# EAGLE design XboxSerialAdapter (EAGLE 9.6.2)
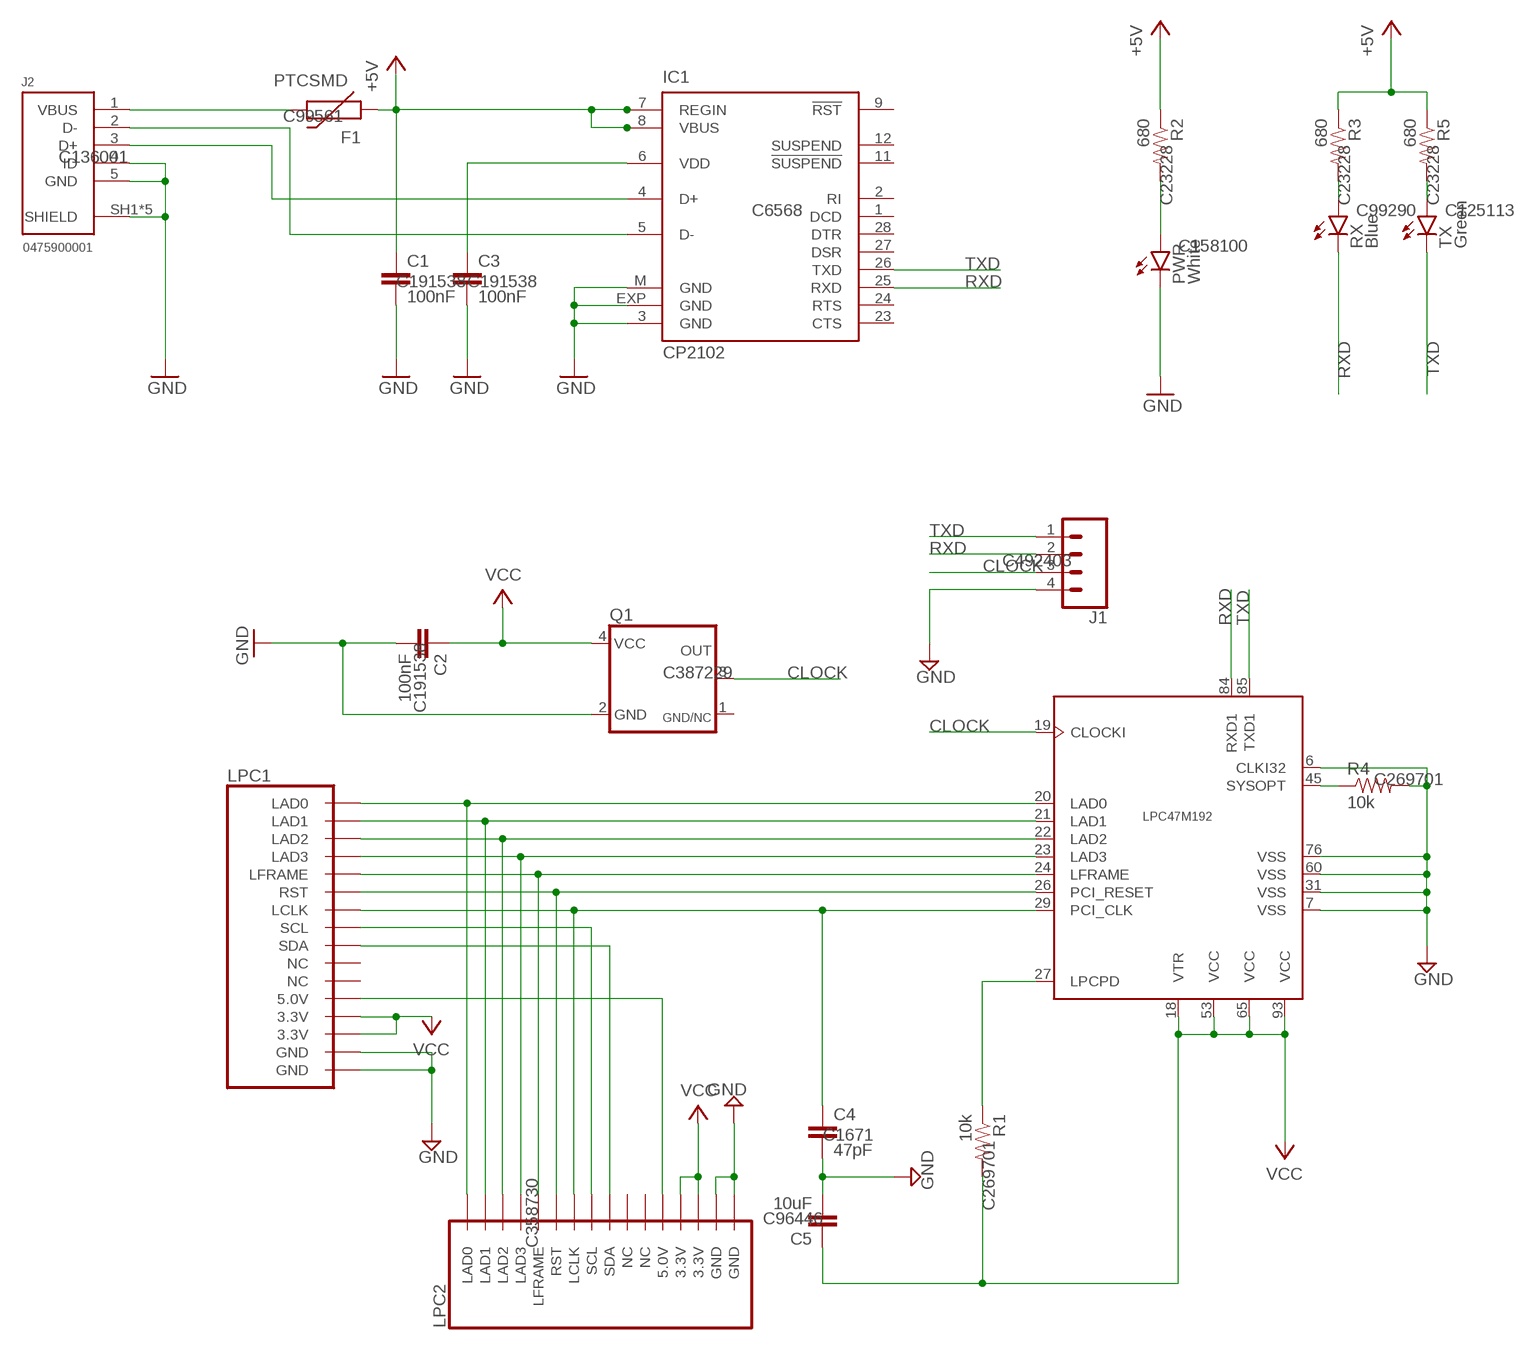
[diagram p0: schematic, sheet 1]

## Parts
C1  100nF  CAP0603-CAP  [0603-CAP]
C2  100nF  CAP0603-CAP  [0603-CAP]
C3  100nF  CAP0603-CAP  [0603-CAP]
C4  47pF  CAP0603-CAP  [0603-CAP]
C5  10uF  CAP0603-CAP  [0603-CAP]
F1  PTCSMD  [PTC-1206]
IC1  CP2102  [MLP28]
J1  CONN_04  [1X04]
J2  0475900001  [0475900001]
LPC1  LPC_HEADERLPC_FEMALE  [HDRVR16W64P254_2X8_1524X508X254B]
LPC2  LPC_HEADERLPC_FEMALE  [HDRVR16W64P254_2X8_1524X508X254B]
PWR  White  LEDCHIP-LED0603  [CHIP-LED0603]
Q1  SCTF_C3872291  [SCTF_C387229]
R1  10k  RESISTOR0603-RES  [0603-RES]
R2  680  RESISTOR0603-RES  [0603-RES]
R3  680  RESISTOR0603-RES  [0603-RES]
R4  10k  RESISTOR0603-RES  [0603-RES]
R5  680  RESISTOR0603-RES  [0603-RES]
RX  Blue  LEDCHIP-LED0603  [CHIP-LED0603]
TX  Green  LEDCHIP-LED0603  [CHIP-LED0603]
U1  LPC47M192  [QFP128]

## Nets
5.0V: LPC1.6(5.0V) LPC2.6(5.0V)
+5V: C1.1 F1.1 IC1.7(REGIN) IC1.8(VBUS) R2.1 R3.1 R5.1
CLOCK: J1.3 Q1.3(OUT) U1.19(CLOCKI)
D+: IC1.4(D+) J2.3(D+)
D-: IC1.5(D-) J2.2(D-)
GND: C1.2 C2.2 C3.2 C4.2 C5.2 IC1.3(GND) IC1.EXP(GND) IC1.M(GND) J1.4 J2.4(ID) J2.5(GND) J2.SH1(SHIELD) J2.SH2(SHIELD) J2.SH3(SHIELD) J2.SH4(SHIELD) J2.SH5(SHIELD) LPC1.2(GND) LPC1.12(GND) LPC2.2(GND) LPC2.12(GND) PWR.C Q1.2(GND) R4.2 U1.6(CLKI32) U1.7(VSS) U1.31(VSS) U1.60(VSS) U1.76(VSS)
LAD0: LPC1.11(LAD0) LPC2.11(LAD0) U1.20(LAD0)
LAD1: LPC1.10(LAD1) LPC2.10(LAD1) U1.21(LAD1)
LAD2: LPC1.8(LAD2) LPC2.8(LAD2) U1.22(LAD2)
LAD3: LPC1.7(LAD3) LPC2.7(LAD3) U1.23(LAD3)
LCLK: C4.1 LPC1.1(LCLK) LPC2.1(LCLK) U1.29(PCI_CLK)
LFRAME: LPC1.3(LFRAME) LPC2.3(LFRAME) U1.24(LFRAME)
N$1: R4.1 U1.45(SYSOPT)
N$2: R5.2 TX.A
N$4: R3.2 RX.A
N$5: C3.1 IC1.6(VDD)
N$6: R1.1 U1.27(LPCPD)
N$8: PWR.A R2.2
RST: LPC1.5(RST) LPC2.5(RST) U1.26(PCI_RESET)
RXD: IC1.25(RXD) J1.2 RX.C U1.84(RXD1)
SCL: LPC1.13(SCL) LPC2.13(SCL)
SDA: LPC1.14(SDA) LPC2.14(SDA)
TXD: IC1.26(TXD) J1.1 TX.C U1.85(TXD1)
VBUS: F1.2 J2.1(VBUS)
VCC: C2.1 C5.1 LPC1.9(3.3V) LPC1.15(3.3V) LPC2.9(3.3V) LPC2.15(3.3V) Q1.4(VCC) R1.2 U1.18(VTR) U1.53(VCC) U1.65(VCC) U1.93(VCC)
Unconnected: IC1.1(DCD) IC1.2(RI) IC1.9(!RST) IC1.11(!SUSPEND) IC1.12(SUSPEND) IC1.23(CTS) IC1.24(RTS) IC1.27(DSR) IC1.28(DTR) LPC1.4(NC) LPC1.16(NC) LPC2.4(NC) LPC2.16(NC)

## Power pins joined to a net without a drawn wire
GND/NC: Q1.1(GND/NC)

## Library data of the parts
C1-C3 = SparkFun:CAP: Capacitor Standard 0603 ceramic capacitor, and 0.1" leaded capacitor.; LCSC_PART: C191538
C4 = SparkFun:CAP: Capacitor Standard 0603 ceramic capacitor, and 0.1" leaded capacitor.; LCSC_PART: C1671
C5 = SparkFun:CAP: Capacitor Standard 0603 ceramic capacitor, and 0.1" leaded capacitor.; LCSC_PART: C96446
F1 = SparkFun:PTC: Resettable Fuse PTC Resettable Fuse. Spark Fun Electronics SKU : COM-08357; LCSC_PART: C99561
IC1 = silabs:CP210*: Single-Chip USB to UART Bridge Source: www.silabs.com .. CP2101.pdf / cp2102.pdf; LCSC_PART: C6568; MF: FARNELL; MPN: CP2102-GM; OC_FARNELL: 9282130; OC_NEWARK: 30K5635
J1 = SparkFun-Connectors:CONN_04: Multi connection point. Often used as Generic Header-pin footprint for 0.1 inch spaced/style header connections On any of the 0.1 inch spaced packages, you can populate with these: Break Away Headers - Straight <https://www.sparkfun.com/products/116> (PRT-00116) Break Away Male Headers - Right Angle <https://www.sparkfun.com/products/553> (PRT-00553) Female Headers <https://www.sparkfun.com/products/115> (PRT-00115) Break Away Headers - Machine Pin <https://www.sparkfun.com/products/117> (PRT-00117) Break Away Female Headers - Swiss Machine Pin <https://www.sparkfun.com/products/743> (PRT-00743) For SCREWTERMINALS and SPRING TERMINALS visit here: Screw Terimnals on SparkFun.com <https://www.sparkfun.com/search/results?term=Screw+Terminals> (5mm/3.5mm/2.54mm spacing) This device is also useful as a general connection point to wire up your design to another part of your project. Our various solder wires solder well into these plated through hole pads. Hook-Up Wire - Assortment (Stranded, 22 AWG) <https://www.sparkfun.com/products/11375> (PRT-11375) Hook-Up Wire - Assortment (Solid Core, 22 AWG) <https://www.sparkfun.com/products/11367> (PRT-11367) View the entire wire category on our website here <https://www.sparkfun.com/categories/141> Special notes: Molex polarized connector foot print use with SKU : PRT-08231 with associated crimp pins and housings. 1MM SMD Version SKU: PRT-10208; LCSC_PART: C492403; PROD_ID: CONN-09696
J2 = USB connector:0475900001: CONN RCPT MICRO USB AB 5P SMD RA Manufacturer's datasheet <https://www.molex.com/pdm_docs/sd/475900001_sd.pdf>; CREATED_BY: PCBLayout.com; DIGIKEY_PARTNO: WM17144TR-ND; LCSC_PART: C136001; MANUFACTURER: Molex; MPN: 0475900001
LPC1 = xbox:LPC_HEADER: Multi connection point. Often used as Generic Header-pin footprint for 0.1 inch spaced/style header connections You can populate with any combo of single row headers, but if you'd like an exact match, check this: Header - 2x8 (Male, 0.1") <https://www.sparkfun.com/products/13156> (PRT-13156) On any of the 0.1 inch spaced packages, you can populate with these: Break Away Headers - Straight <https://www.sparkfun.com/products/116> (PRT-00116) Break Away Male Headers - Right Angle <https://www.sparkfun.com/products/553> (PRT-00553) Female Headers <https://www.sparkfun.com/products/115> (PRT-00115) Break Away Headers - Machine Pin <https://www.sparkfun.com/products/117> (PRT-00117) Break Away Female Headers - Swiss Machine Pin <https://www.sparkfun.com/products/743> (PRT-00743); LCSC_PART: C492425
LPC2 = xbox:LPC_HEADER: Multi connection point. Often used as Generic Header-pin footprint for 0.1 inch spaced/style header connections You can populate with any combo of single row headers, but if you'd like an exact match, check this: Header - 2x8 (Male, 0.1") <https://www.sparkfun.com/products/13156> (PRT-13156) On any of the 0.1 inch spaced packages, you can populate with these: Break Away Headers - Straight <https://www.sparkfun.com/products/116> (PRT-00116) Break Away Male Headers - Right Angle <https://www.sparkfun.com/products/553> (PRT-00553) Female Headers <https://www.sparkfun.com/products/115> (PRT-00115) Break Away Headers - Machine Pin <https://www.sparkfun.com/products/117> (PRT-00117) Break Away Female Headers - Swiss Machine Pin <https://www.sparkfun.com/products/743> (PRT-00743); LCSC_PART: C358730
PWR = led:LED: LED OSRAM: - CHIPLED LG R971, LG N971, LY N971, LG Q971, LY Q971, LO R971, LY R971 LH N974, LH R974 LS Q976, LO Q976, LY Q976 LO Q996 - Hyper CHIPLED LW Q18S LB Q993, LB Q99A, LB R99A - SideLED LS A670, LO A670, LY A670, LG A670, LP A670 LB A673, LV A673, LT A673, LW A673 LH A674 LY A675 LS A676, LA A676, LO A676, LY A676, LW A676 LS A679, LY A679, LG A679 - Hyper Micro SIDELED® LS Y876, LA Y876, LO Y876, LY Y876 LT Y87S - SmartLED LW L88C, LW L88S LB L89C, LB L89S, LG L890 LS L89K, LO L89K, LY L89K LS L896, LA L896, LO L896, LY L896 - TOPLED LS T670, LO T670, LY T670, LG T670, LP T670 LSG T670, LSP T670, LSY T670, LOP T670, LYG T670 LG T671, LOG T671, LSG T671 LB T673, LV T673, LT T673, LW T673 LH T674 LS T676, LA T676, LO T676, LY T676, LB T676, LH T676, LSB T676, LW T676 LB T67C, LV T67C, LT T67C, LS T67K, LO T67K, LY T67K, LW E67C LS E67B, LA E67B, LO E67B, LY E67B, LB E67C, LV E67C, LT E67C LW T67C LS T679, LY T679, LG T679 LS T770, LO T770, LY T770, LG T770, LP T770 LB T773, LV T773, LT T773, LW T773 LH T774 LS E675, LA E675, LY E675, LS T675 LS T776, LA T776, LO T776, LY T776, LB T776 LHGB T686 LT T68C, LB T68C - Hyper Mini TOPLED® LB M676 - Mini TOPLED Santana® LG M470 LS M47K, LO M47K, LY M47K Source: http://www.osram.convergy.de LUXEON: - LUMILED® LXK2-PW12-R00, LXK2-PW12-S00, LXK2-PW14-U00, LXK2-PW14-V00 LXK2-PM12-R00, LXK2-PM12-S00, LXK2-PM14-U00 LXK2-PE12-Q00, LXK2-PE12-R00, LXK2-PE12-S00, LXK2-PE14-T00, LXK2-PE14-U00 LXK2-PB12-K00, LXK2-PB12-L00, LXK2-PB12-M00, LXK2-PB14-N00, LXK2-PB14-P00, LXK2-PB14-Q00 LXK2-PR12-L00, LXK2-PR12-M00, LXK2-PR14-Q00, LXK2-PR14-R00 LXK2-PD12-Q00, LXK2-PD12-R00, LXK2-PD12-S00 LXK2-PH12-R00, LXK2-PH12-S00 LXK2-PL12-P00, LXK2-PL12-Q00, LXK2-PL12-R00 Source: www.luxeon.com KINGBRIGHT: KA-3528ASYC Source: www.kingbright.com; LCSC_PART: C158100
Q1 = xbox:SCTF_C387229: TCXO : CMOS - Serie Model Size l/w/h [mm] Frequency Range Frequency Stability Temp. Range [°C] Output AECQ 200 availabel Datasheet KXO-86 KXO-84 KXO-83 KXO-82 2.5/2.0/0.7 3.2/2.5/1.0 5.0/3.2/1.5 7.0/5.0/2.4 13,0 ~ 40,0 MHz 10,0 ~ 40,0 MHz 10,0 ~ 40,0 MHz 10,0 ~ 30,0 MHz ±1,0 … ±2,5ppm ±1,0 … ±2,5ppm ±1,0 … ±3,0ppm ±1,0 … ±3,0ppm (*) -30°C …+75°C (*) -40°C …+85°C (*) -40°C …+85°C (*) -30°C …+80°C CMOS CMOS CMOS CMOS - - - - KXO-86.pdf <http://www.geyer-electronic.de/uploads/tx_userartikelfrequenz/GEYER-KXO-86-TCXO-HCMOS.pdf> KXO-84.pdf <http://www.geyer-electronic.de/uploads/tx_userartikelfrequenz/GEYER-KXO-84-TCXO-HCMOS.pdf> KXO-83.pdf <http://www.geyer-electronic.de/uploads/tx_userartikelfrequenz/GEYER-KXO-83-TCXO-HCMOS.pdf> KXO-82.pdf <http://www.geyer-electronic.de/uploads/tx_userartikelfrequenz/GEYER-KXO-82-TCXO-HCMOS.pdf> <http://www.geyer-electronic.de/fileadmin/template/img/logo-geyer-electronic.png> Details see: http://www.geyer-electronic.de/Frequenz-Produkte.9.0.html Created 2016-06-07, Hans Locher 2016 (C) Geyer Quartz Technology KXO86,KXO84,KXO83,KXO82;2550;3225;5032;7050;2,5x2,0;3,2x2,5;2.5x2.0;3.2x2.5,5,0x3,2;7,0x5,0,5.0x3.2,7.0x5.0; LCSC_PART: C387229
R1 R4 = SparkFun:RESISTOR: Resistor Basic schematic elements and footprints for 0603, 1206, and PTH resistors.; LCSC_PART: C269701
R2 R3 R5 = SparkFun:RESISTOR: Resistor Basic schematic elements and footprints for 0603, 1206, and PTH resistors.; LCSC_PART: C23228
RX = led:LED: LED OSRAM: - CHIPLED LG R971, LG N971, LY N971, LG Q971, LY Q971, LO R971, LY R971 LH N974, LH R974 LS Q976, LO Q976, LY Q976 LO Q996 - Hyper CHIPLED LW Q18S LB Q993, LB Q99A, LB R99A - SideLED LS A670, LO A670, LY A670, LG A670, LP A670 LB A673, LV A673, LT A673, LW A673 LH A674 LY A675 LS A676, LA A676, LO A676, LY A676, LW A676 LS A679, LY A679, LG A679 - Hyper Micro SIDELED® LS Y876, LA Y876, LO Y876, LY Y876 LT Y87S - SmartLED LW L88C, LW L88S LB L89C, LB L89S, LG L890 LS L89K, LO L89K, LY L89K LS L896, LA L896, LO L896, LY L896 - TOPLED LS T670, LO T670, LY T670, LG T670, LP T670 LSG T670, LSP T670, LSY T670, LOP T670, LYG T670 LG T671, LOG T671, LSG T671 LB T673, LV T673, LT T673, LW T673 LH T674 LS T676, LA T676, LO T676, LY T676, LB T676, LH T676, LSB T676, LW T676 LB T67C, LV T67C, LT T67C, LS T67K, LO T67K, LY T67K, LW E67C LS E67B, LA E67B, LO E67B, LY E67B, LB E67C, LV E67C, LT E67C LW T67C LS T679, LY T679, LG T679 LS T770, LO T770, LY T770, LG T770, LP T770 LB T773, LV T773, LT T773, LW T773 LH T774 LS E675, LA E675, LY E675, LS T675 LS T776, LA T776, LO T776, LY T776, LB T776 LHGB T686 LT T68C, LB T68C - Hyper Mini TOPLED® LB M676 - Mini TOPLED Santana® LG M470 LS M47K, LO M47K, LY M47K Source: http://www.osram.convergy.de LUXEON: - LUMILED® LXK2-PW12-R00, LXK2-PW12-S00, LXK2-PW14-U00, LXK2-PW14-V00 LXK2-PM12-R00, LXK2-PM12-S00, LXK2-PM14-U00 LXK2-PE12-Q00, LXK2-PE12-R00, LXK2-PE12-S00, LXK2-PE14-T00, LXK2-PE14-U00 LXK2-PB12-K00, LXK2-PB12-L00, LXK2-PB12-M00, LXK2-PB14-N00, LXK2-PB14-P00, LXK2-PB14-Q00 LXK2-PR12-L00, LXK2-PR12-M00, LXK2-PR14-Q00, LXK2-PR14-R00 LXK2-PD12-Q00, LXK2-PD12-R00, LXK2-PD12-S00 LXK2-PH12-R00, LXK2-PH12-S00 LXK2-PL12-P00, LXK2-PL12-Q00, LXK2-PL12-R00 Source: www.luxeon.com KINGBRIGHT: KA-3528ASYC Source: www.kingbright.com; LCSC_PART: C99290
TX = led:LED: LED OSRAM: - CHIPLED LG R971, LG N971, LY N971, LG Q971, LY Q971, LO R971, LY R971 LH N974, LH R974 LS Q976, LO Q976, LY Q976 LO Q996 - Hyper CHIPLED LW Q18S LB Q993, LB Q99A, LB R99A - SideLED LS A670, LO A670, LY A670, LG A670, LP A670 LB A673, LV A673, LT A673, LW A673 LH A674 LY A675 LS A676, LA A676, LO A676, LY A676, LW A676 LS A679, LY A679, LG A679 - Hyper Micro SIDELED® LS Y876, LA Y876, LO Y876, LY Y876 LT Y87S - SmartLED LW L88C, LW L88S LB L89C, LB L89S, LG L890 LS L89K, LO L89K, LY L89K LS L896, LA L896, LO L896, LY L896 - TOPLED LS T670, LO T670, LY T670, LG T670, LP T670 LSG T670, LSP T670, LSY T670, LOP T670, LYG T670 LG T671, LOG T671, LSG T671 LB T673, LV T673, LT T673, LW T673 LH T674 LS T676, LA T676, LO T676, LY T676, LB T676, LH T676, LSB T676, LW T676 LB T67C, LV T67C, LT T67C, LS T67K, LO T67K, LY T67K, LW E67C LS E67B, LA E67B, LO E67B, LY E67B, LB E67C, LV E67C, LT E67C LW T67C LS T679, LY T679, LG T679 LS T770, LO T770, LY T770, LG T770, LP T770 LB T773, LV T773, LT T773, LW T773 LH T774 LS E675, LA E675, LY E675, LS T675 LS T776, LA T776, LO T776, LY T776, LB T776 LHGB T686 LT T68C, LB T68C - Hyper Mini TOPLED® LB M676 - Mini TOPLED Santana® LG M470 LS M47K, LO M47K, LY M47K Source: http://www.osram.convergy.de LUXEON: - LUMILED® LXK2-PW12-R00, LXK2-PW12-S00, LXK2-PW14-U00, LXK2-PW14-V00 LXK2-PM12-R00, LXK2-PM12-S00, LXK2-PM14-U00 LXK2-PE12-Q00, LXK2-PE12-R00, LXK2-PE12-S00, LXK2-PE14-T00, LXK2-PE14-U00 LXK2-PB12-K00, LXK2-PB12-L00, LXK2-PB12-M00, LXK2-PB14-N00, LXK2-PB14-P00, LXK2-PB14-Q00 LXK2-PR12-L00, LXK2-PR12-M00, LXK2-PR14-Q00, LXK2-PR14-R00 LXK2-PD12-Q00, LXK2-PD12-R00, LXK2-PD12-S00 LXK2-PH12-R00, LXK2-PH12-S00 LXK2-PL12-P00, LXK2-PL12-Q00, LXK2-PL12-R00 Source: www.luxeon.com KINGBRIGHT: KA-3528ASYC Source: www.kingbright.com; LCSC_PART: C125113
U1 = xbox:LPC47M192

## Board
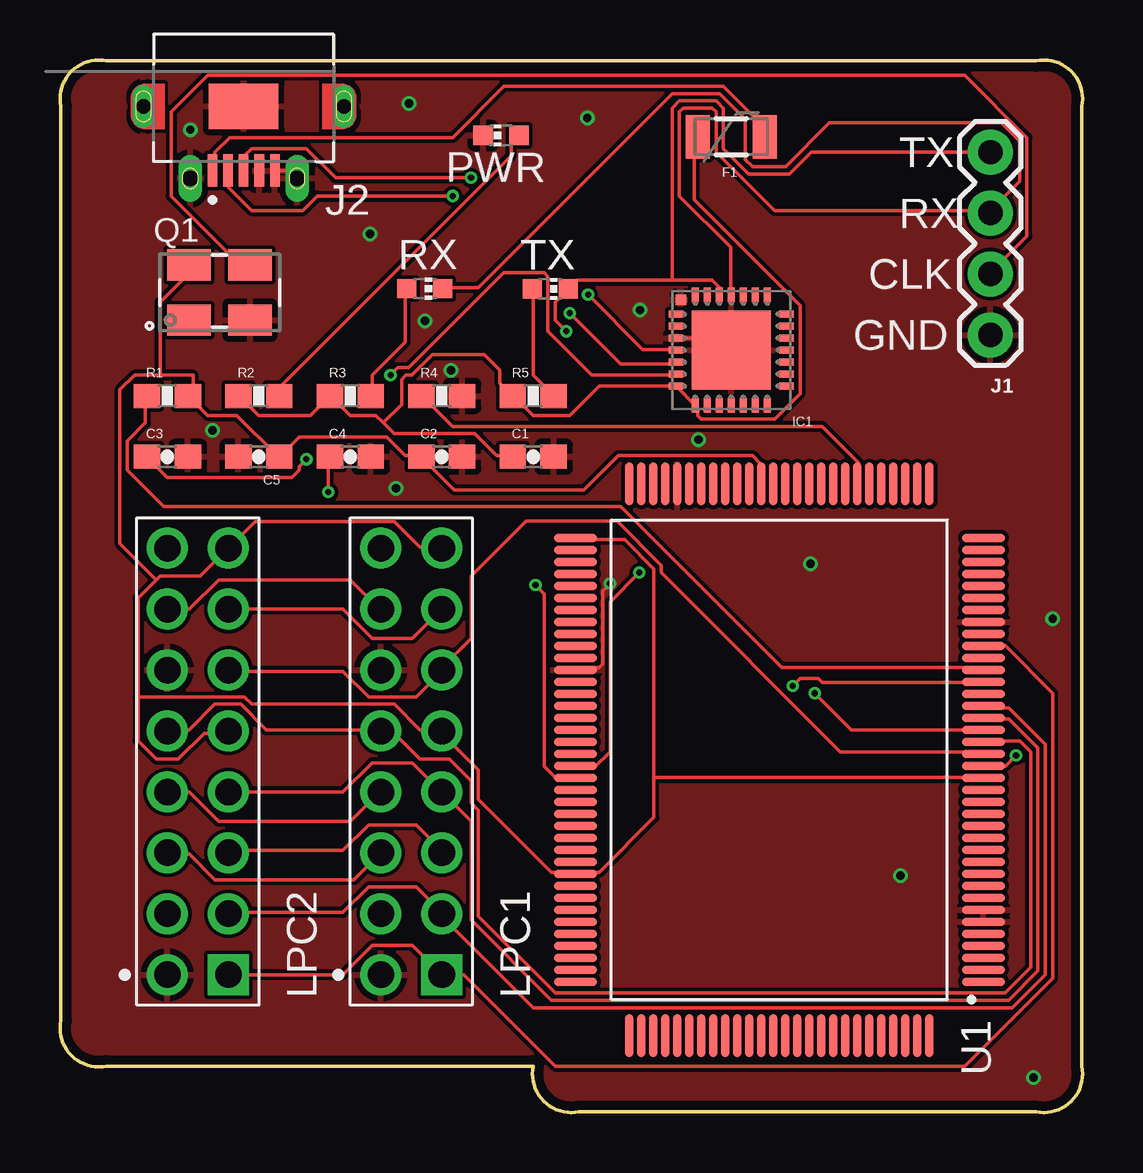
[diagram p1: board, top side]
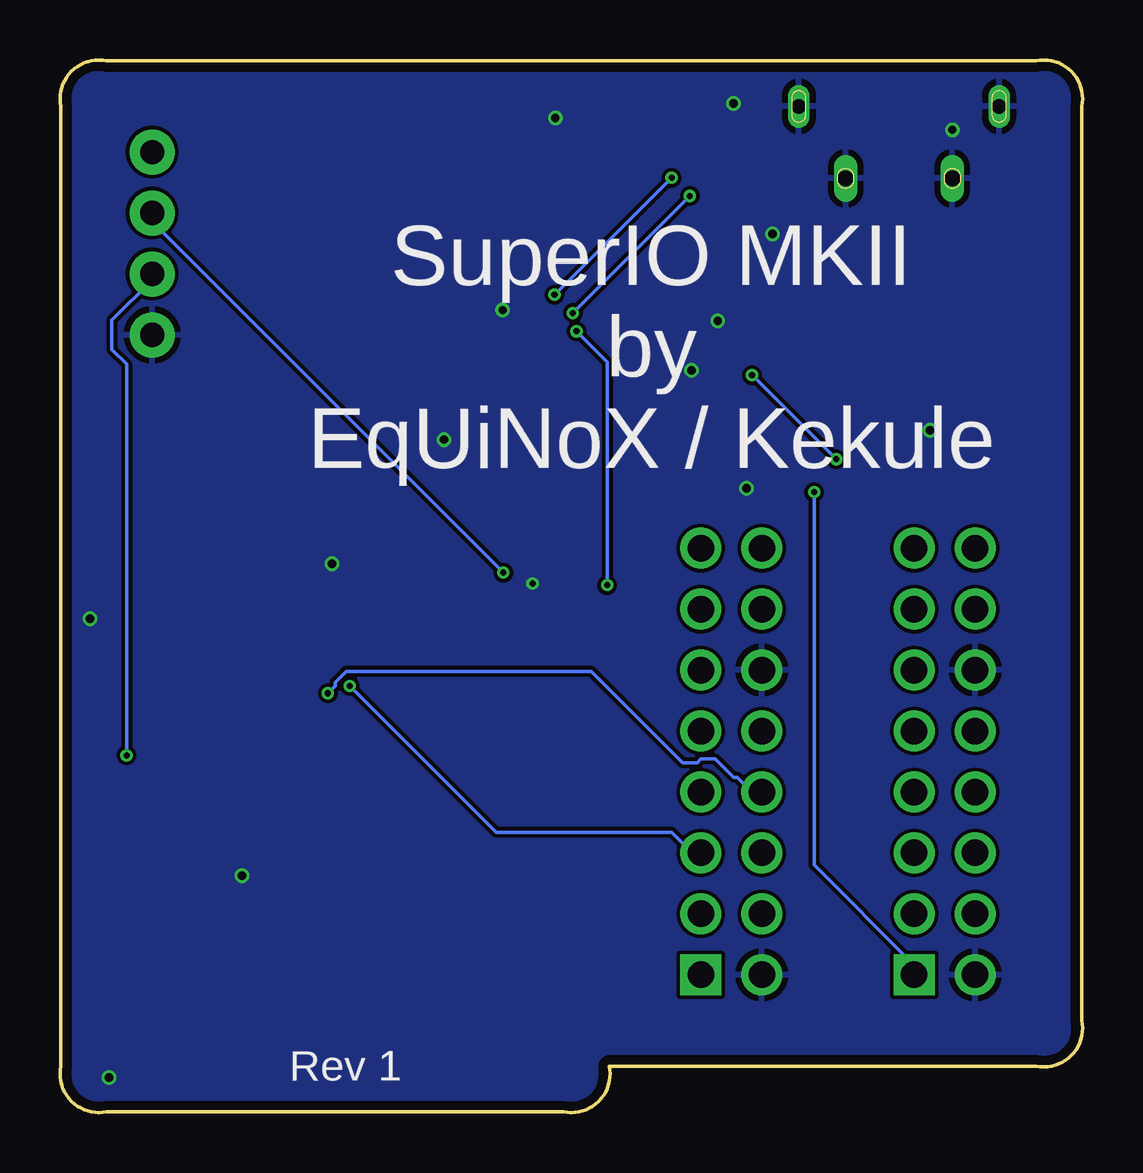
[diagram p2: board, bottom side, seen from below]

Size 42.61 x 43.88 mm. Coordinates in mm from the lower left corner, seen from the top.
Outline: 0.03,41.94 arc-113 1.94,43.85 40.67,43.85 arc-113 42.58,41.94 42.58,1.94 arc-113 40.67,0.03 21.62,0.03 arc-113 19.72,1.94 1.94,1.94 arc-113 0.03,3.84 0.03,41.94
Copper layers (1*16): Top 0.035559375mm / dielectric 1.6mm / Bottom 0.035559375mm
Design rules "oshpark-2layer": minimum track width 6mil, minimum drill 10mil, track to track 6mil, track to pad 6mil, pad to pad 6mil, via to via 6mil, smd to smd 6mil, copper to edge 15mil, drill to drill 6mil, minimum pad ring 5mil, minimum via ring 5mil, stop-mask expansion 2.5mil, vias tented up to drill 0mil, thermal gap 10mil

### Footprints (pad centres in the part's own frame; a part is rotated, then mirrored left to right if it is on the bottom)
0603-CAP = smd 1.1 x 1: 1 -0.85,0; 2 0.85,0
PTC-1206 = smd 1 x 1.8: 1 -1.4,0; 2 1.4,0
MLP28 = smd 0.6 x 0.3: 1 -2.3,1.5; 2 -2.3,1; 3 -2.3,0.5; 4 -2.3,0; 5 -2.3,-0.5; 6 -2.3,-1; 7 -2.3,-1.5; 15 2.3,-1.5; 16 2.3,-1; 17 2.3,-0.5; 18 2.3,0; 19 2.3,0.5; 20 2.3,1; 21 2.3,1.5 | smd 0.3 x 0.6: 8 -1.5,-2.3; 9 -1,-2.3; 10 -0.5,-2.3; 11 0,-2.3; 12 0.5,-2.3; 13 1,-2.3; 14 1.5,-2.3; 22 1.5,2.3; 23 1,2.3; 24 0.5,2.3; 25 0,2.3; 26 -0.5,2.3; 27 -1,2.3; 28 -1.5,2.3 | smd 3.3 x 3.3: EXP 0,0 | smd 0.435 x 0.435: M -2.103,2.103
1X04 = drill 1.016 pad 1.88: 1 0,0; 2 2.54,0; 3 5.08,0; 4 7.62,0
0475900001 = smd 0.4 x 1.35: 1 1.3,2.675; 2 0.65,2.675; 3 0,2.675; 4 -0.65,2.675; 5 -1.3,2.675 | drill 0.65 pad 0.85 long: SH1 -2.225,3; SH2 2.225,3 | drill 0.6 pad 0.8 long: SH3 -4.175,0; SH4 4.175,0 | smd 2.9 x 1.9: SH5 0,0
HDRVR16W64P254_2X8_1524X508X254B = drill 1.105 pad 1.705 square: 1 0,-2.54 | drill 1.105 pad 1.705: 2 0,0; 3 2.54,-2.54; 4 2.54,0; 5 5.08,-2.54; 6 5.08,0; 7 7.62,-2.54; 8 7.62,0; 9 10.16,-2.54; 10 10.16,0; 11 12.7,-2.54; 12 12.7,0; 13 15.24,-2.54; 14 15.24,0; 15 17.78,-2.54; 16 17.78,0
CHIP-LED0603 = smd 0.8 x 0.8: A 0,-0.75; C 0,0.75
SCTF_C387229 = smd 1.8 x 1.3: 1 -1.27,-1.15; 2 1.27,-1.15; 3 1.27,1.15; 4 -1.27,1.15
0603-RES = smd 1.1 x 1: 1 -0.85,0; 2 0.85,0
QFP128 = smd 0.356 x 1.8: 1 2.25,-2.25; 2 2.75,-2.25; 3 3.25,-2.25; 4 3.75,-2.25; 5 4.25,-2.25; 6 4.75,-2.25; 7 5.25,-2.25; 8 5.75,-2.25; 9 6.25,-2.25; 10 6.75,-2.25; 11 7.25,-2.25; 12 7.75,-2.25; 13 8.25,-2.25; 14 8.75,-2.25; 15 9.25,-2.25; 16 9.75,-2.25; 17 10.25,-2.25; 18 10.75,-2.25; 19 11.25,-2.25; 20 11.75,-2.25; 21 12.25,-2.25; 22 12.75,-2.25; 23 13.25,-2.25; 24 13.75,-2.25; 25 14.25,-2.25; 26 14.75,-2.25; 27 15.25,-2.25; 28 15.75,-2.25; 29 16.25,-2.25; 30 16.75,-2.25; 31 17.25,-2.25; 32 17.75,-2.25; 33 18.25,-2.25; 34 18.75,-2.25; 35 19.25,-2.25; 36 19.75,-2.25; 37 20.25,-2.25; 38 20.75,-2.25; 65 20.75,14.75; 66 20.25,14.75; 67 19.75,14.75; 68 19.25,14.75; 69 18.75,14.75; 70 18.25,14.75; 71 17.75,14.75; 72 17.25,14.75; 73 16.75,14.75; 74 16.25,14.75; 75 15.75,14.75; 76 15.25,14.75; 77 14.75,14.75; 78 14.25,14.75; 79 13.75,14.75; 80 13.25,14.75; 81 12.75,14.75; 82 12.25,14.75; 83 11.75,14.75; 84 11.25,14.75; 85 10.75,14.75; 86 10.25,14.75; 87 9.75,14.75; 88 9.25,14.75; 89 8.75,14.75; 90 8.25,14.75; 91 7.75,14.75; 92 7.25,14.75; 93 6.75,14.75; 94 6.25,14.75; 95 5.75,14.75; 96 5.25,14.75; 97 4.75,14.75; 98 4.25,14.75; 99 3.75,14.75; 100 3.25,14.75; 101 2.75,14.75; 102 2.25,14.75 | smd 1.8 x 0.356: 39 23,0; 40 23,0.5; 41 23,1; 42 23,1.5; 43 23,2; 44 23,2.5; 45 23,3; 46 23,3.5; 47 23,4; 48 23,4.5; 49 23,5; 50 23,5.5; 51 23,6; 52 23,6.5; 53 23,7; 54 23,7.5; 55 23,8; 56 23,8.5; 57 23,9; 58 23,9.5; 59 23,10; 60 23,10.5; 61 23,11; 62 23,11.5; 63 23,12; 64 23,12.5; 103 0,12.5; 104 0,12; 105 0,11.5; 106 0,11; 107 0,10.5; 108 0,10; 109 0,9.5; 110 0,9; 111 0,8.5; 112 0,8; 113 0,7.5; 114 0,7; 115 0,6.5; 116 0,6; 117 0,5.5; 118 0,5; 119 0,4.5; 120 0,4; 121 0,3.5; 122 0,3; 123 0,2.5; 124 0,2; 125 0,1.5; 126 0,1; 127 0,0.5; 128 0,0

### Placement (x,y rotation side)
C1  19.72,27.34 0 top
C2  15.91,27.34 0 top
C3  4.48,27.34 0 top
C4  12.1,27.34 0 top
C5  8.29,27.34 180 top
F1  27.97,40.67 0 top
IC1  27.97,31.78 0 top
J1  38.77,40.04 270 top
J2  7.65,41.94 180 top
LPC1  13.37,5.75 90 top
LPC2  4.48,5.75 90 top
PWR  18.38,40.73 90 top
Q1  6.65,34.19 0 top
R1  4.48,29.88 0 top
R2  8.29,29.88 0 top
R3  12.1,29.88 0 top
R4  15.91,29.88 0 top
R5  19.72,29.88 0 top
RX  15.2,34.35 270 top
TX  20.42,34.33 270 top
U1  36.23,3.21 90 top

### Tracks (layer width: path | path; a pad name or v marks a point on that pad's centre or on a via)
5.0V
  Top 0.152: LPC1.6 12.25,9.71 6.46,9.71 5.39,10.78 4.48,10.78 LPC2.6
+5V
  Top 0.152: 26.42,39.88 26.42,40.65 F1.1 26.42,39.88 | 13.47,28.76 13.16,29.06 12.1,29.06 11.33,29.83 R3.1 11.18,29.83 10.42,29.06 8.29,29.06 7.52,29.83 R2.1 | 13.47,28.76 13.93,28.3 17.28,28.3 18.19,27.39 18.8,27.39 C1.1 | 26.42,39.88 26.42,38.06 30.84,33.64 30.84,29.98 29.77,28.91 26.73,28.91 26.57,29.06 26.57,29.37 IC1.8 IC1.7 25.51,30.28 22.46,30.28 21.24,29.06 19.72,29.06 18.95,29.83 R5.1 18.33,30.42 18.33,30.95 17.68,31.59 15.51,31.59 14.66,30.74 14.41,30.74 14.23,30.56 14.23,29.52 13.47,28.76
CLOCK  (via drill 0.25)
  Top 0.152: 39.38,14.43 38.61,14.43 U1.19 39.38,14.43 | J1.3 38.77,35.01 40.29,36.53 40.29,40.65 37.7,43.24 6.15,43.24 4.63,41.71 4.63,38.21 7.37,35.46 7.83,35.46 Q1.3 | v39.83,14.89 39.38,14.43
  Bottom 0.152: v39.83,14.89 39.83,31.2 40.44,31.81 40.44,33.03 38.77,34.7 J1.3
D+  (via drill 0.25)
  Top 0.152: IC1.4 25.36,31.81 24.29,31.81 v22,34.09 | v17.13,38.97 11.49,38.97 10.27,40.19 7.98,40.19 7.68,39.88 7.68,39.27 J2.3
  Bottom 0.152: v17.13,38.97 v22,34.09
D-  (via drill 0.25)
  Top 0.152: v21.24,33.33 23.37,31.2 25.51,31.2 IC1.5 | v16.36,38.21 10.72,38.21 10.12,37.6 7.98,37.6 7,38.58 J2.2
  Bottom 0.152: v16.36,38.21 v21.24,33.33
GND  (via drill 0.25, 0.35)
  Top 0.152: 27.95,31.81 IC1.EXP | 27.95,31.81 27.9,31.86 | v22.92,22.05 22.61,21.75 22.61,18.7 22.46,18.55 21.55,18.55 U1.76 | IC1.M 25.81,33.94 25.81,33.92 | IC1.3 27.47,32.28 27.95,31.81 | J2.5 9.55,39.27 J2.SH1
  other vias: 5.43,40.97 24.16,33.45 14.54,42.06 6.36,28.45 21.97,41.46 12.92,36.63 31.27,22.87 26.61,28.05 16.29,30.94 15.2,33.01 14.01,26.02 35.02,9.87 40.57,1.46 41.36,20.59
  pour Top: -1.87,45.75 43.85,45.75 43.85,-0.6 -1.87,-0.6
  pour Bottom: -1.87,46.39 45.12,46.39 45.12,-0.6 -1.87,-0.6
LAD0
  Top 0.152: U1.20 38.46,15.04 32.52,15.04 25.05,22.51 25.05,22.82 23.21,24.66 19.42,24.66 17.13,22.36 17.13,19.77 15.91,18.55 LPC1.11 15.91,18.4 14.84,17.33 12.86,17.33 11.79,18.4 7.07,18.4 LPC2.11
LAD1
  Top 0.152: U1.21 38.61,15.5 39.99,15.5 40.44,15.04 40.44,6.05 39.38,4.98 20.63,4.98 17.43,8.18 17.43,12.6 17.13,12.91 17.13,13.82 16.21,14.74 14.99,14.74 13.93,15.8 13.47,15.8 LPC1.10 13.32,15.96 8.59,15.96 7.52,17.02 6.46,17.02 5.39,15.96 4.48,15.96 LPC2.10
LAD2  (via drill 0.25)
  Top 0.152: v31.45,17.48 32.98,15.96 38.46,15.96 U1.22 | LPC2.8 5.39,13.37 6.61,12.15 12.1,12.15 13.32,13.37 LPC1.8
  Bottom 0.152: v31.45,17.48 31.15,17.79 31.15,17.94 30.69,18.4 20.48,18.4 16.67,14.59 16.06,14.59 15.91,14.74 15.3,14.74 14.53,13.98 14.38,13.98 13.77,13.37 LPC1.8
LAD3
  Top 0.152: U1.23 38.61,16.41 39.53,16.41 40.75,15.2 40.75,5.9 39.53,4.68 20.48,4.68 17.13,8.03 17.13,12.15 LPC1.7 14.69,14.59 13.01,14.59 11.79,13.37 LPC2.7
LCLK  (via drill 0.25)
  Top 0.152: 39.38,19.46 38.61,19.46 U1.29 39.38,19.46 | v11.18,25.86 11.18,27.23 C4.1 | 39.38,19.46 41.36,17.48 41.36,5.59 37.7,1.94 20.63,1.94 16.82,5.75 LPC1.1 14.69,6.97 13.01,6.97 11.79,5.75 LPC2.1
  Bottom 0.152: 7.07,6.2 7.07,5.75 LPC2.1 7.07,6.2 | v11.18,25.86 11.18,10.32 7.07,6.2
LFRAME
  Top 0.152: U1.24 38.61,16.87 39.53,16.87 41.05,15.35 41.05,5.75 39.68,4.37 19.72,4.37 15.91,8.18 LPC1.3 15.91,8.34 14.84,9.4 12.86,9.4 11.79,8.34 7.07,8.34 LPC2.3
N$1
  Top 0.152: 33.28,27.08 33.28,26.32 U1.45 33.28,27.08 | 33.28,27.08 31.76,28.61 16.36,28.61 15.14,29.83 R4.1
N$2
  Top 0.152: 19.72,33.94 19.72,34.25 TX.A 19.72,33.94 | 19.72,33.94 19.72,30.74 20.48,29.98 R5.2
N$4
  Top 0.152: RX.A 14.38,34.25 14.38,32.11 13.01,30.74 13.01,29.98 R3.2
N$5  (via drill 0.25)
  Top 0.152: IC1.6 25.36,30.74 22.15,30.74 20.33,32.57 20.33,34.85 20.17,35.01 18.5,35.01 14.53,31.04 14.08,31.04 v13.77,30.74 | v10.27,27.23 9.96,26.93 9.96,26.78 9.66,26.47 4.48,26.47 3.71,27.23 C3.1
  Bottom 0.152: v10.27,27.23 v13.77,30.74
N$6
  Top 0.152: U1.27 38.46,18.55 30.08,18.55 23.37,25.25 4.32,25.25 2.8,26.78 2.8,28 3.56,28.76 3.56,29.83 R1.1
N$8
  Top 0.152: 18.8,40.65 19.11,40.65 PWR.A 18.8,40.65 | 18.8,40.65 18.8,39.88 9.2,30.28 9.2,29.98 R2.2
RST  (via drill 0.25)
  Top 0.152: v30.54,17.79 30.84,18.09 31.6,18.09 31.76,17.94 38.46,17.94 U1.26 | LPC2.5 7.07,10.93 11.79,10.93 12.86,11.99 14.84,11.99 15.91,10.93 LPC1.5
  Bottom 0.152: v30.54,17.79 24.44,11.69 17.13,11.69 16.36,10.93 15.91,10.93 LPC1.5
RXD  (via drill 0.25)
  Top 0.152: U1.84 21.55,14.43 22.31,14.43 22.92,15.04 22.92,21.29 v24.14,22.51 | 38.77,37.6 29.77,37.6 27.34,40.04 27.34,41.71 27.18,41.87 25.96,41.87 25.81,41.71 25.81,38.21 27.95,36.07 27.95,34.09 IC1.25 | 38.77,37.6 39.99,38.82 39.99,40.49 39.22,41.26 32.06,41.26 30.23,39.43 28.86,39.43 28.56,39.73 28.56,41.41 27.49,42.47 25.51,42.47 17.43,34.4 16.06,34.4 RX.C | 38.77,37.6 J1.2
  Bottom 0.152: v24.14,22.51 38.77,37.14 J1.2
SCL
  Top 0.152: LPC2.13 11.79,20.99 13.01,19.77 14.69,19.77 LPC1.13
SDA
  Top 0.152: LPC2.14 5.39,20.99 6.61,22.21 12.1,22.21 13.32,20.99 LPC1.14
TXD  (via drill 0.25)
  Top 0.152: 20.63,13.98 21.39,13.98 U1.85 20.63,13.98 | 25.51,34.7 21.55,34.7 21.24,34.4 TX.C 21.09,34.25 20.63,33.79 20.63,33.03 v21.09,32.57 | 25.51,34.7 27.18,34.7 27.49,34.4 27.49,34.09 IC1.26 | 20.63,13.98 20.17,14.43 20.17,21.63 v19.81,21.99 | 25.51,34.7 25.51,41.87 25.81,42.17 27.34,42.17 27.64,41.87 27.64,40.19 28.71,39.12 30.38,39.12 31.3,40.04 J1.1
  Bottom 0.152: v19.81,21.99 19.81,31.29 v21.09,32.57
VBUS
  Top 0.152: J2.1 6.46,39.27 6.46,40.04 7.07,40.65 16.36,40.65 18.5,42.78 27.64,42.78 29.32,41.1 29.32,40.8 F1.2
VCC
  Top 0.152: 29.17,27.08 29.17,26.32 U1.53 29.17,27.08 | 24.75,13.98 24.75,12.3 22.46,10.01 21.55,10.01 U1.93 21.39,10.01 20.48,10.01 17.43,13.06 17.43,14.28 15.91,15.8 LPC1.9 15.91,15.96 14.99,15.96 13.93,17.02 7.98,17.02 7.68,17.33 3.26,17.33 | 24.75,13.98 24.75,22.66 23.53,23.88 21.55,23.88 U1.65 | 24.75,13.98 38.46,13.98 U1.18 | 3.26,17.33 3.26,21.44 4.02,22.21 | 3.26,17.33 3.26,15.5 4.02,14.74 4.93,14.74 6,15.8 6.91,15.8 LPC2.9 | 4.02,22.21 4.17,22.36 5.85,22.36 LPC2.15 8.13,24.64 13.93,24.64 14.99,23.58 15.91,23.58 LPC1.15 | 29.17,27.08 28.86,27.39 23.26,27.39 21.82,25.95 16.43,25.95 15.14,27.23 C2.1 14.99,27.39 14.38,27.39 13.62,28.15 9.96,28.15 9.2,27.39 C5.1 9.05,27.39 7.37,29.06 6.15,29.06 5.39,29.83 R1.2 5.39,29.98 5.54,30.13 5.54,30.74 4.17,30.74 | 4.02,22.21 2.5,23.73 2.5,30.13 3.1,30.74 4.17,30.74 | 4.17,30.74 4.17,33.79 5.24,34.85 5.24,35.31 Q1.4

### Text on the board
tNames: TX | RX | CLK | GND
bNames: SuperIO MKII / by / EqUiNoX / Kekule | Rev 1